# EAGLE design phaser (EAGLE 7.2.0)
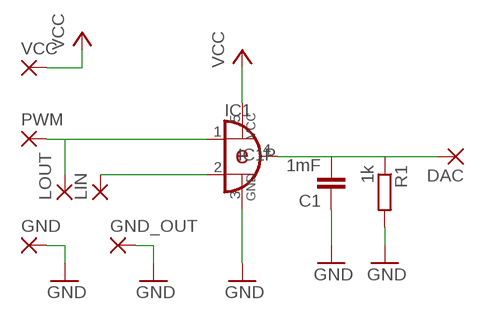
[diagram p0: schematic, sheet 1]

## Parts
C1  1mF  C-EUC0805  [C0805]
DAC  SMD2  [SMD1,27-2,54]
GND  SMD2  [SMD1,27-2,54]
GND_OUT  SMD2  [SMD1,27-2,54]
IC1  74AHC1G86DCK  [SC70-5]
LIN  SMD2  [SMD1,27-2,54]
LOUT  SMD2  [SMD1,27-2,54]
PWM  SMD2  [SMD1,27-2,54]
R1  1k  R-EU_R0805  [R0805]
VCC  SMD2  [SMD1,27-2,54]

## Nets
GND: C1.1 GND.1(P) GND_OUT.1(P) IC1.3(GND) R1.2
N$1: IC1.1(I0) LOUT.1(P) PWM.1(P)
N$2: IC1.2(I1) LIN.1(P)
N$3: C1.2 DAC.1(P) IC1.4(O) R1.1
VCC: IC1.5(VCC) VCC.1(P)

## Library data of the parts
C1 = rcl:C-EU: CAPACITOR, European symbol
DAC GND GND_OUT LIN LOUT PWM VCC = wirepad:SMD2: SMD PAD
IC1 = 74xx-little-de:74*1G86: 2-input EXCLUSIV-OR gate
R1 = rcl:R-EU_: RESISTOR, European symbol

## Board
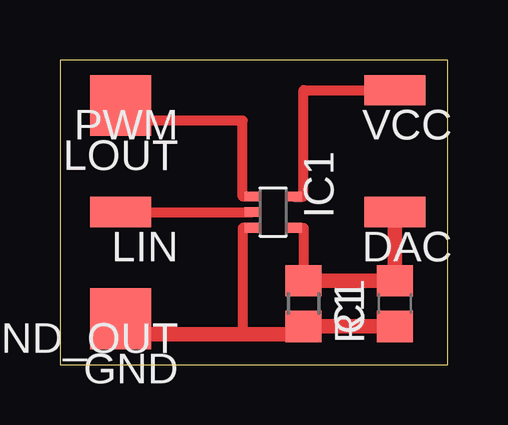
[diagram p1: board, top side]

Size 16.18 x 12.69 mm. Coordinates in mm from the lower left corner, seen from the top.
Outline: 0,0 16.18,0 16.18,12.69 0,12.69 0,0
Copper layers (1*16): Top 0.035mm / dielectric 1.5mm / Bottom 0.035mm
Design rules "default": minimum track width 10mil, minimum drill 24mil, track to track 8mil, track to pad 8mil, pad to pad 8mil, via to via 8mil, smd to smd 8mil, copper to edge 40mil, drill to drill 8mil, minimum pad ring 10mil, minimum via ring 8mil, stop-mask expansion 4mil, vias tented up to drill 0mil, thermal gap 10mil

### Footprints (pad centres in the part's own frame; a part is rotated, then mirrored left to right if it is on the bottom)
C0805 = smd 1.3 x 1.5: 1 -0.95,0; 2 0.95,0
SMD1,27-2,54 = smd 1.27 x 2.54: 1 0,0
SC70-5 = smd 0.4 x 0.7: 1 -0.65,-0.85; 2 0,-0.85; 3 0.65,-0.85; 4 0.65,0.85; 5 -0.65,0.85
R0805 = smd 1.3 x 1.5: 1 -0.95,0; 2 0.95,0

### Placement (x,y rotation side)
C1  13.97,2.54 90 top
DAC  13.97,6.35 90 top
GND  2.54,1.27 90 top
GND_OUT  2.54,2.54 90 top
IC1  8.89,6.35 270 top
LIN  2.54,6.35 90 top
LOUT  2.54,10.16 90 top
PWM  2.54,11.43 90 top
R1  10.16,2.54 270 top
VCC  13.97,11.43 90 top

### Tracks (layer width: path | path; a pad name or v marks a point on that pad's centre or on a via)
GND
  Top 0.406: IC1.3 7.62,5.7 7.62,1.27
  Top 0.61: GND_OUT.1 GND.1 7.62,1.27 10.16,1.27 R1.2 C1.1
N$1
  Top 0.406: IC1.1 7.62,7 7.62,10.16 LOUT.1
  Top 0.61: PWM.1 LOUT.1
N$2
  Top 0.406: LIN.1 IC1.2
N$3
  Top 0.406: IC1.4 10.16,5.7 R1.1
  Top 0.61: R1.1 C1.2 DAC.1
VCC
  Top 0.406: IC1.5 10.16,7 10.16,11.43 VCC.1